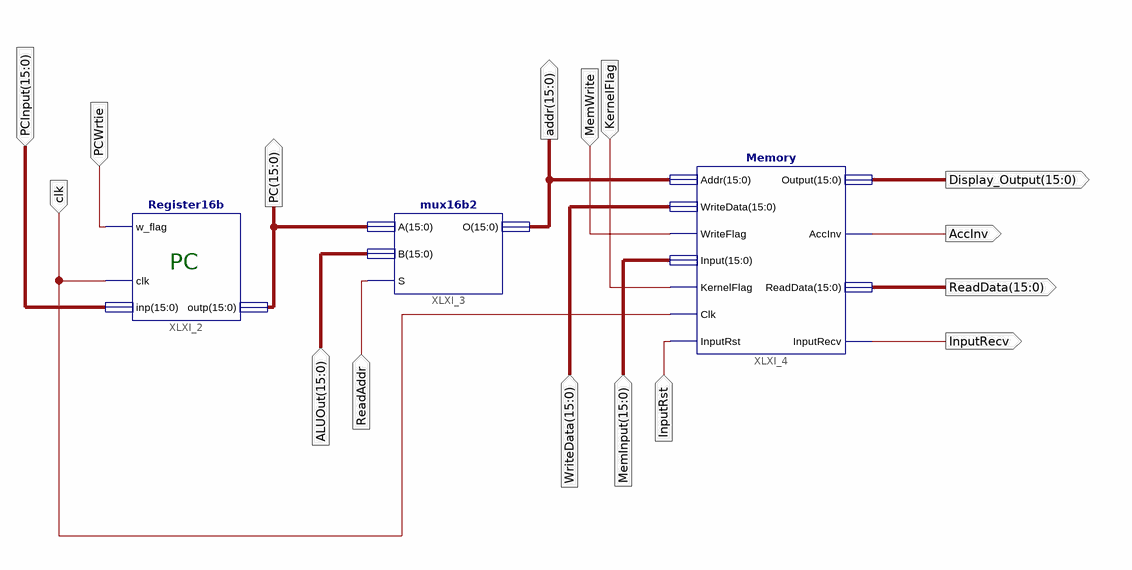
[diagram p0: schematic sheet 1]
// Xilinx ISE schematic PC_Mem_Unit.sch (artix7) as structural Verilog: 3 symbols, 16 ports
module PC_Mem_Unit (
  input  PCWrtie,
  input  clk,
  input  [15:0] PCInput,
  input  [15:0] ALUOut,
  input  ReadAddr,
  input  KernelFlag,
  input  InputRst,
  input  [15:0] MemInput,
  input  MemWrite,
  input  [15:0] WriteData,
  output [15:0] PC,
  output [15:0] addr,
  output [15:0] Display_Output,
  output InputRecv,
  output [15:0] ReadData,
  output AccInv
);

  Register16b XLXI_2 (.w_flag(PCWrtie), .clk(clk), .inp(PCInput), .outp(PC));
  mux16b2 XLXI_3 (.A(PC), .B(ALUOut), .S(ReadAddr), .O(addr));
  Memory XLXI_4 (
    .Addr(addr), .WriteData(WriteData), .WriteFlag(MemWrite), .Input(MemInput), .KernelFlag(KernelFlag),
    .Clk(clk), .InputRst(InputRst), .Output(Display_Output), .AccInv(AccInv), .ReadData(ReadData),
    .InputRecv(InputRecv));

  // Notes on the sheet:
  //   PC
endmodule
